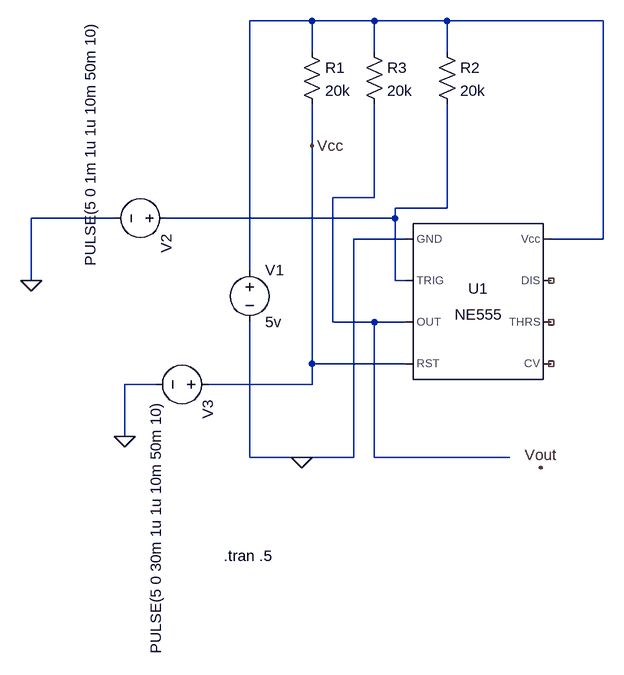
[diagram p0: schematic Q3_BISTABLE.asc]
Q3_BISTABLE.asc, the LTspice schematic file:
Version 4.1
SHEET 1 880 680
WIRE 160 -608 64 -608
WIRE 256 -608 160 -608
WIRE 368 -608 256 -608
WIRE 608 -608 368 -608
WIRE 160 -560 160 -608
WIRE 256 -560 256 -608
WIRE 368 -560 368 -608
WIRE 160 -416 160 -480
WIRE 256 -336 256 -480
WIRE 256 -336 192 -336
WIRE 368 -320 368 -480
WIRE 368 -320 288 -320
WIRE -144 -304 -272 -304
WIRE 288 -304 288 -320
WIRE 288 -304 -64 -304
WIRE 304 -272 224 -272
WIRE 608 -272 608 -608
WIRE 608 -272 528 -272
WIRE 64 -224 64 -608
WIRE -272 -208 -272 -304
WIRE 288 -208 288 -304
WIRE 304 -208 288 -208
WIRE 192 -144 192 -336
WIRE 256 -144 192 -144
WIRE 304 -144 256 -144
WIRE 160 -80 160 -416
WIRE 304 -80 160 -80
WIRE -80 -48 -128 -48
WIRE 160 -48 160 -80
WIRE 160 -48 0 -48
WIRE -128 32 -128 -48
WIRE 64 64 64 -144
WIRE 144 64 64 64
WIRE 224 64 224 -272
WIRE 224 64 144 64
WIRE 256 64 256 -144
WIRE 464 64 256 64
FLAG 144 64 0
FLAG 160 -416 Vcc
FLAG 512 80 Vout
FLAG -272 -208 0
FLAG -128 32 0
SYMBOL Misc\\NE555 416 -176 R0
SYMATTR InstName U1
SYMBOL voltage 64 -240 R0
WINDOW 123 0 0 Left 0
WINDOW 39 0 0 Left 0
SYMATTR InstName V1
SYMATTR Value 5v
SYMBOL res 240 -576 R0
SYMATTR InstName R3
SYMATTR Value 20k
SYMBOL res 352 -576 R0
SYMATTR InstName R2
SYMATTR Value 20k
SYMBOL voltage -48 -304 R90
WINDOW 3 -304 133 Left 2
WINDOW 123 0 0 Left 0
WINDOW 39 0 0 Left 0
SYMATTR Value PULSE(5 0 1m 1u 1u 10m 50m 10)
SYMATTR InstName V2
SYMBOL res 144 -576 R0
SYMATTR InstName R1
SYMATTR Value 20k
SYMBOL voltage 16 -48 R90
WINDOW 123 0 0 Left 0
WINDOW 39 0 0 Left 0
SYMATTR InstName V3
SYMATTR Value PULSE(5 0 30m 1u 1u 10m 50m 10)
TEXT 24 216 Left 2 !.tran .5

The netlist it stands for:
* Q3_BISTABLE.asc
X§U1 0 N003 N002 Vcc NC_01 NC_02 NC_03 N001 NE555  ; pins GND TRIG OUT RST CV THRS DIS Vcc
V1 N001 0 5v
R3 N001 N002 20k
R2 N001 N003 20k
V2 N003 0 PULSE(5 0 1m 1u 1u 10m 50m 10)
R1 N001 Vcc 20k
V3 Vcc 0 PULSE(5 0 30m 1u 1u 10m 50m 10)
.tran .5
.lib NE555.sub
.backanno
.end